# EAGLE schematic schematic (EAGLE 7.4.0)
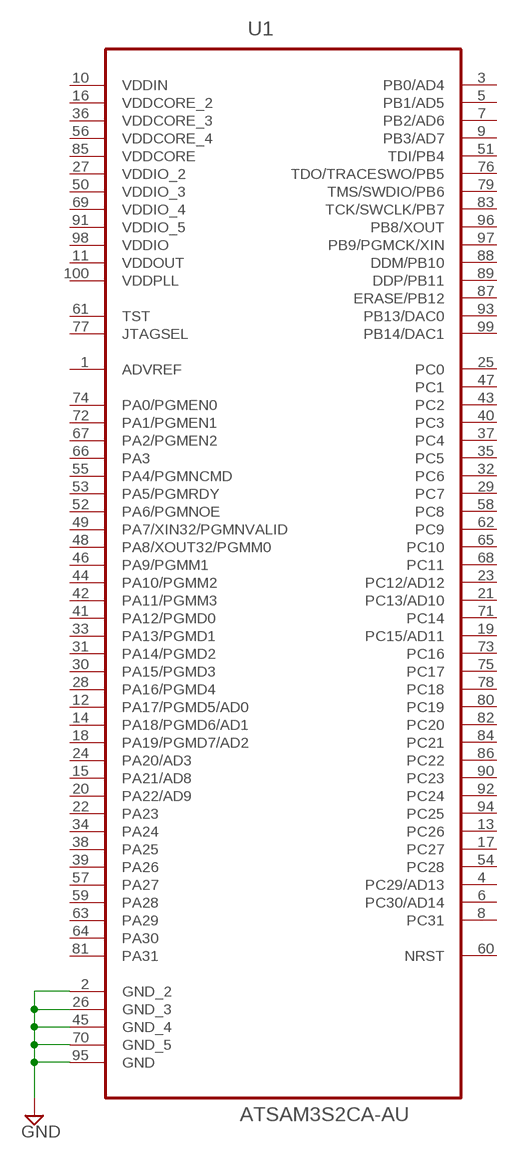
[diagram p0: schematic, sheet 1]

## Parts
U1  ATSAM3S2CA-AU  [QFP50P1600X1600X160-100N]

## Nets
GND: U1.2(GND_2) U1.26(GND_3) U1.45(GND_4) U1.70(GND_5) U1.95(GND)
Unconnected: U1.1(ADVREF) U1.3(PB0/AD4) U1.4(PC29/AD13) U1.5(PB1/AD5) U1.6(PC30/AD14) U1.7(PB2/AD6) U1.8(PC31) U1.9(PB3/AD7) U1.12(PA17/PGMD5/AD0) U1.13(PC26) U1.14(PA18/PGMD6/AD1) U1.15(PA21/AD8) U1.17(PC27) U1.18(PA19/PGMD7/AD2) U1.19(PC15/AD11) U1.20(PA22/AD9) U1.21(PC13/AD10) U1.22(PA23) U1.23(PC12/AD12) U1.24(PA20/AD3) U1.25(PC0) U1.28(PA16/PGMD4) U1.29(PC7) U1.30(PA15/PGMD3) U1.31(PA14/PGMD2) U1.32(PC6) U1.33(PA13/PGMD1) U1.34(PA24) U1.35(PC5) U1.37(PC4) U1.38(PA25) U1.39(PA26) U1.40(PC3) U1.41(PA12/PGMD0) U1.42(PA11/PGMM3) U1.43(PC2) U1.44(PA10/PGMM2) U1.46(PA9/PGMM1) U1.47(PC1) U1.48(PA8/XOUT32/PGMM0) U1.49(PA7/XIN32/PGMNVALID) U1.51(TDI/PB4) U1.52(PA6/PGMNOE) U1.53(PA5/PGMRDY) U1.54(PC28) U1.55(PA4/PGMNCMD) U1.57(PA27) U1.58(PC8) U1.59(PA28) U1.60(NRST) U1.61(TST) U1.62(PC9) U1.63(PA29) U1.64(PA30) U1.65(PC10) U1.66(PA3) U1.67(PA2/PGMEN2) U1.68(PC11) U1.71(PC14) U1.72(PA1/PGMEN1) U1.73(PC16) U1.74(PA0/PGMEN0) U1.75(PC17) U1.76(TDO/TRACESWO/PB5) U1.77(JTAGSEL) U1.78(PC18) U1.79(TMS/SWDIO/PB6) U1.80(PC19) U1.81(PA31) U1.82(PC20) U1.83(TCK/SWCLK/PB7) U1.84(PC21) U1.86(PC22) U1.87(ERASE/PB12) U1.88(DDM/PB10) U1.89(DDP/PB11) U1.90(PC23) U1.92(PC24) U1.93(PB13/DAC0) U1.94(PC25) U1.96(PB8/XOUT) U1.97(PB9/PGMCK/XIN) U1.99(PB14/DAC1)

## Power pins joined to a net without a drawn wire
VDDCORE: U1.85(VDDCORE)
VDDCORE_2: U1.16(VDDCORE_2)
VDDCORE_3: U1.36(VDDCORE_3)
VDDCORE_4: U1.56(VDDCORE_4)
VDDIN: U1.10(VDDIN)
VDDIO: U1.98(VDDIO)
VDDIO_2: U1.27(VDDIO_2)
VDDIO_3: U1.50(VDDIO_3)
VDDIO_4: U1.69(VDDIO_4)
VDDIO_5: U1.91(VDDIO_5)
VDDOUT: U1.11(VDDOUT)
VDDPLL: U1.100(VDDPLL)

## Library data of the parts
U1 = Atmel_By_element14_Batch_1-00:ATSAM3S2CA-AU: AT91 ARM Cortex M3-based Processor; DESCRIPTION: AT91 ARM Cortex M3-based Processor; MPN: ATSAM3S2CA-AU; OC_FARNELL: 1841654; OC_NEWARK: 12T1312; PACKAGE: LQFP-100; SUPPLIER: Atmel Corporation